# EAGLE design Trivisynth (EAGLE 6.5.0)
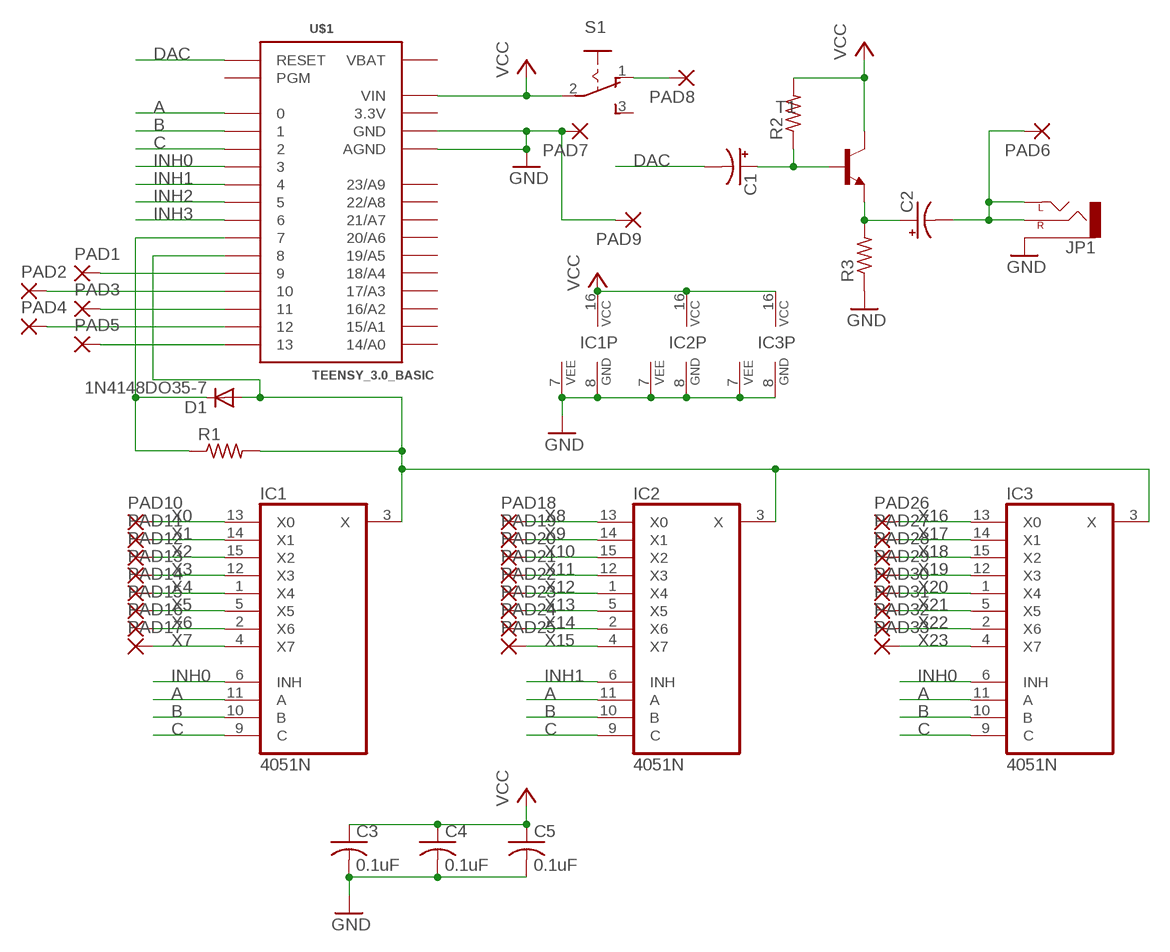
[diagram p0: schematic, sheet 1]

## Parts
C1  CPOL-USE2-5  [E2-5]
C2  CPOL-USE2-5  [E2-5]
C3  0.1uF  C-US025-025X050  [C025-025X050]
C4  0.1uF  C-US025-025X050  [C025-025X050]
C5  0.1uF  C-US025-025X050  [C025-025X050]
D1  1N4148DO35-7  [DO35-7]
IC1  4051N  [DIL16]
IC2  4051N  [DIL16]
IC3  4051N  [DIL16]
JP1  AUDIO-JACKPTH  [AUDIO-JACK]
PAD1  2,15/1,0  [2,15/1,0]
PAD2  2,15/1,0  [2,15/1,0]
PAD3  2,15/1,0  [2,15/1,0]
PAD4  2,15/1,0  [2,15/1,0]
PAD5  2,15/1,0  [2,15/1,0]
PAD6  2,15/1,0  [2,15/1,0]
PAD7  2,15/1,0  [2,15/1,0]
PAD8  2,15/1,0  [2,15/1,0]
PAD9  2,15/1,0  [2,15/1,0]
PAD10  2,15/1,0  [2,15/1,0]
PAD11  2,15/1,0  [2,15/1,0]
PAD12  2,15/1,0  [2,15/1,0]
PAD13  2,15/1,0  [2,15/1,0]
PAD14  2,15/1,0  [2,15/1,0]
PAD15  2,15/1,0  [2,15/1,0]
PAD16  2,15/1,0  [2,15/1,0]
PAD17  2,15/1,0  [2,15/1,0]
PAD18  2,15/1,0  [2,15/1,0]
PAD19  2,15/1,0  [2,15/1,0]
PAD20  2,15/1,0  [2,15/1,0]
PAD21  2,15/1,0  [2,15/1,0]
PAD22  2,15/1,0  [2,15/1,0]
PAD23  2,15/1,0  [2,15/1,0]
PAD24  2,15/1,0  [2,15/1,0]
PAD25  2,15/1,0  [2,15/1,0]
PAD26  2,15/1,0  [2,15/1,0]
PAD27  2,15/1,0  [2,15/1,0]
PAD28  2,15/1,0  [2,15/1,0]
PAD29  2,15/1,0  [2,15/1,0]
PAD30  2,15/1,0  [2,15/1,0]
PAD31  2,15/1,0  [2,15/1,0]
PAD32  2,15/1,0  [2,15/1,0]
PAD33  2,15/1,0  [2,15/1,0]
R1  R-US_0207/10  [0207/10]
R2  R-US_0207/10  [0207/10]
R3  R-US_0207/10  [0207/10]
S1  255SB  [255SB]
T1  -NPN-TO92-EBC  [TO92-EBC]
U$1  TEENSY_3.0_BASIC  [TEENSY_3.0_BASIC]

## Nets
A: IC1.11(A) IC2.11(A) IC3.11(A) U$1.0
B: IC1.10(B) IC2.10(B) IC3.10(B) U$1.1
C: IC1.9(C) IC2.9(C) IC3.9(C) U$1.2
DAC: C1.- U$1.RESET
GND: C3.2 C4.2 C5.2 IC1.7(VEE) IC1.8(GND) IC2.7(VEE) IC2.8(GND) IC3.7(VEE) IC3.8(GND) JP1.SLEEVE PAD7.1(P) PAD9.1(P) R3.1 U$1.AGND U$1.GND U$1.GND1(GND)
INH0: IC1.6(INH) IC3.6(INH) U$1.3
INH1: IC2.6(INH) U$1.4
INH2: U$1.5
INH3: U$1.6
N$1: PAD8.1(P) S1.1(O)
N$2: D1.A IC1.3(X) IC2.3(X) IC3.3(X) R1.2 U$1.8
N$3: C1.+ R2.1 T1.B
N$4: C2.+ R3.2 T1.E
N$5: D1.C R1.1 U$1.7
N$6: C2.- JP1.RING(RIGHT) JP1.TIP(LEFT) PAD6.1(P)
N$7: PAD1.1(P) U$1.9
N$8: PAD2.1(P) U$1.10
N$9: PAD3.1(P) U$1.11
N$10: PAD4.1(P) U$1.12
N$11: PAD5.1(P) U$1.13
VCC: C3.1 C4.1 C5.1 IC1.16(VCC) IC2.16(VCC) IC3.16(VCC) R2.2 S1.2(P) T1.C U$1.VIN
X0: IC1.13(X0) PAD10.1(P)
X1: IC1.14(X1) PAD11.1(P)
X2: IC1.15(X2) PAD12.1(P)
X3: IC1.12(X3) PAD13.1(P)
X4: IC1.1(X4) PAD14.1(P)
X5: IC1.5(X5) PAD15.1(P)
X6: IC1.2(X6) PAD16.1(P)
X7: IC1.4(X7) PAD17.1(P)
X8: IC2.13(X0) PAD18.1(P)
X9: IC2.14(X1) PAD19.1(P)
X10: IC2.15(X2) PAD20.1(P)
X11: IC2.12(X3) PAD21.1(P)
X12: IC2.1(X4) PAD22.1(P)
X13: IC2.5(X5) PAD23.1(P)
X14: IC2.2(X6) PAD24.1(P)
X15: IC2.4(X7) PAD25.1(P)
X16: IC3.13(X0) PAD26.1(P)
X17: IC3.14(X1) PAD27.1(P)
X18: IC3.15(X2) PAD28.1(P)
X19: IC3.12(X3) PAD29.1(P)
X20: IC3.1(X4) PAD30.1(P)
X21: IC3.5(X5) PAD31.1(P)
X22: IC3.2(X6) PAD32.1(P)
X23: IC3.4(X7) PAD33.1(P)
Unconnected: S1.3(S) U$1.14/A0 U$1.15/A1 U$1.16/A2 U$1.17/A3 U$1.18/A4 U$1.19/A5 U$1.20/A6 U$1.21/A7 U$1.22/A8 U$1.23/A9 U$1.PGM

## Power pins joined to a net without a drawn wire
3.3V: U$1.3.3V U$1.3.3V1(3.3V)
VBAT: U$1.VBAT

## Library data of the parts
C1 C2 = rcl:CPOL-US: POLARIZED CAPACITOR, American symbol
C3-C5 = rcl:C-US: CAPACITOR, American symbol
D1 = diode:1N4148: DIODE high speed (Philips)
IC1-IC3 = 40xx:4051: 8-channel ANALOG MULTIPLEXER
JP1 = SparkFun-Connectors:AUDIO-JACK: 3.5mm Audio Jack Simple 3.5mm common PCB mount audio jack. Variant PTH is our storefront SKU PRT-08032
PAD1-PAD33 = wirepad:2,15/1,0: THROUGH-HOLE PAD
R1-R3 = rcl:R-US_: RESISTOR, American symbol
S1 = switch:255SB: SLIDING SWITCH Distributor Buerklin, 11G810
T1 = transistor:*-NPN-: NPN Transistror BF959 corrected 2008.03.06
U$1 = Teensy3.0:TEENSY_3.0_BASIC: Basic Teensy 3.0 with none of the 'inner' pins enabled. See '+4', 'AllAnalogPins", and 'AllPins' packages for additional pin holes, as needed.

## Board
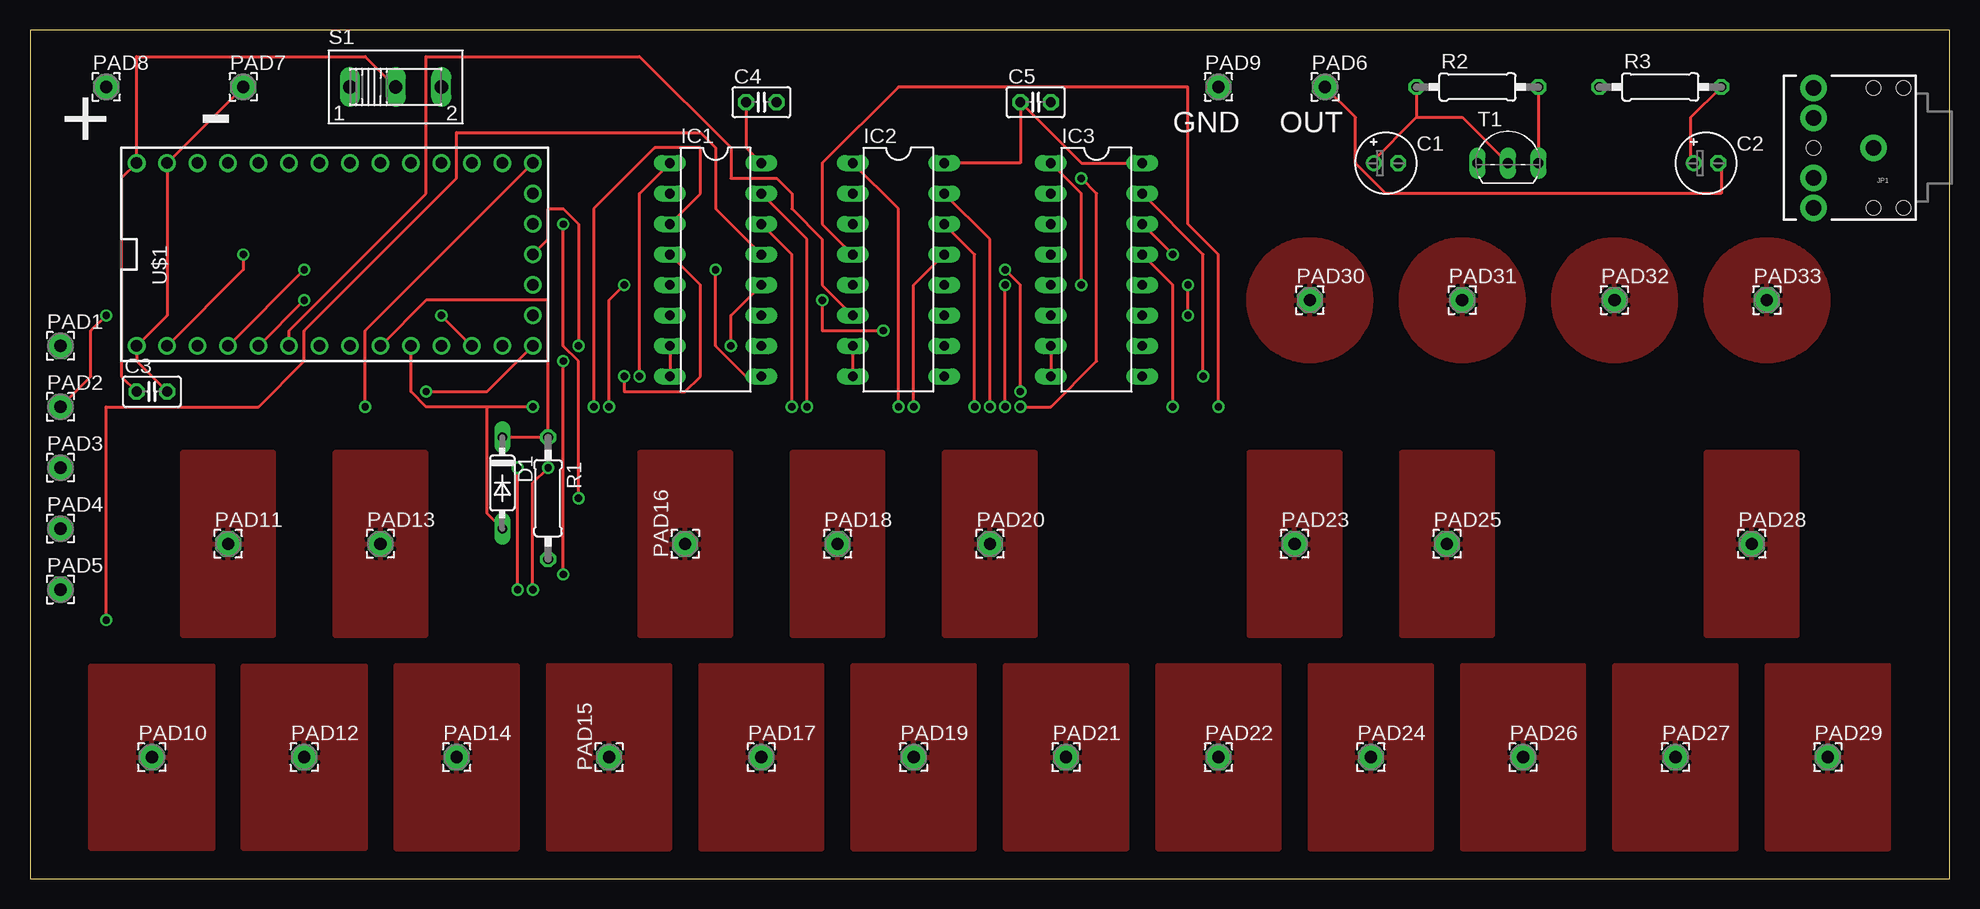
[diagram p1: board, top side]
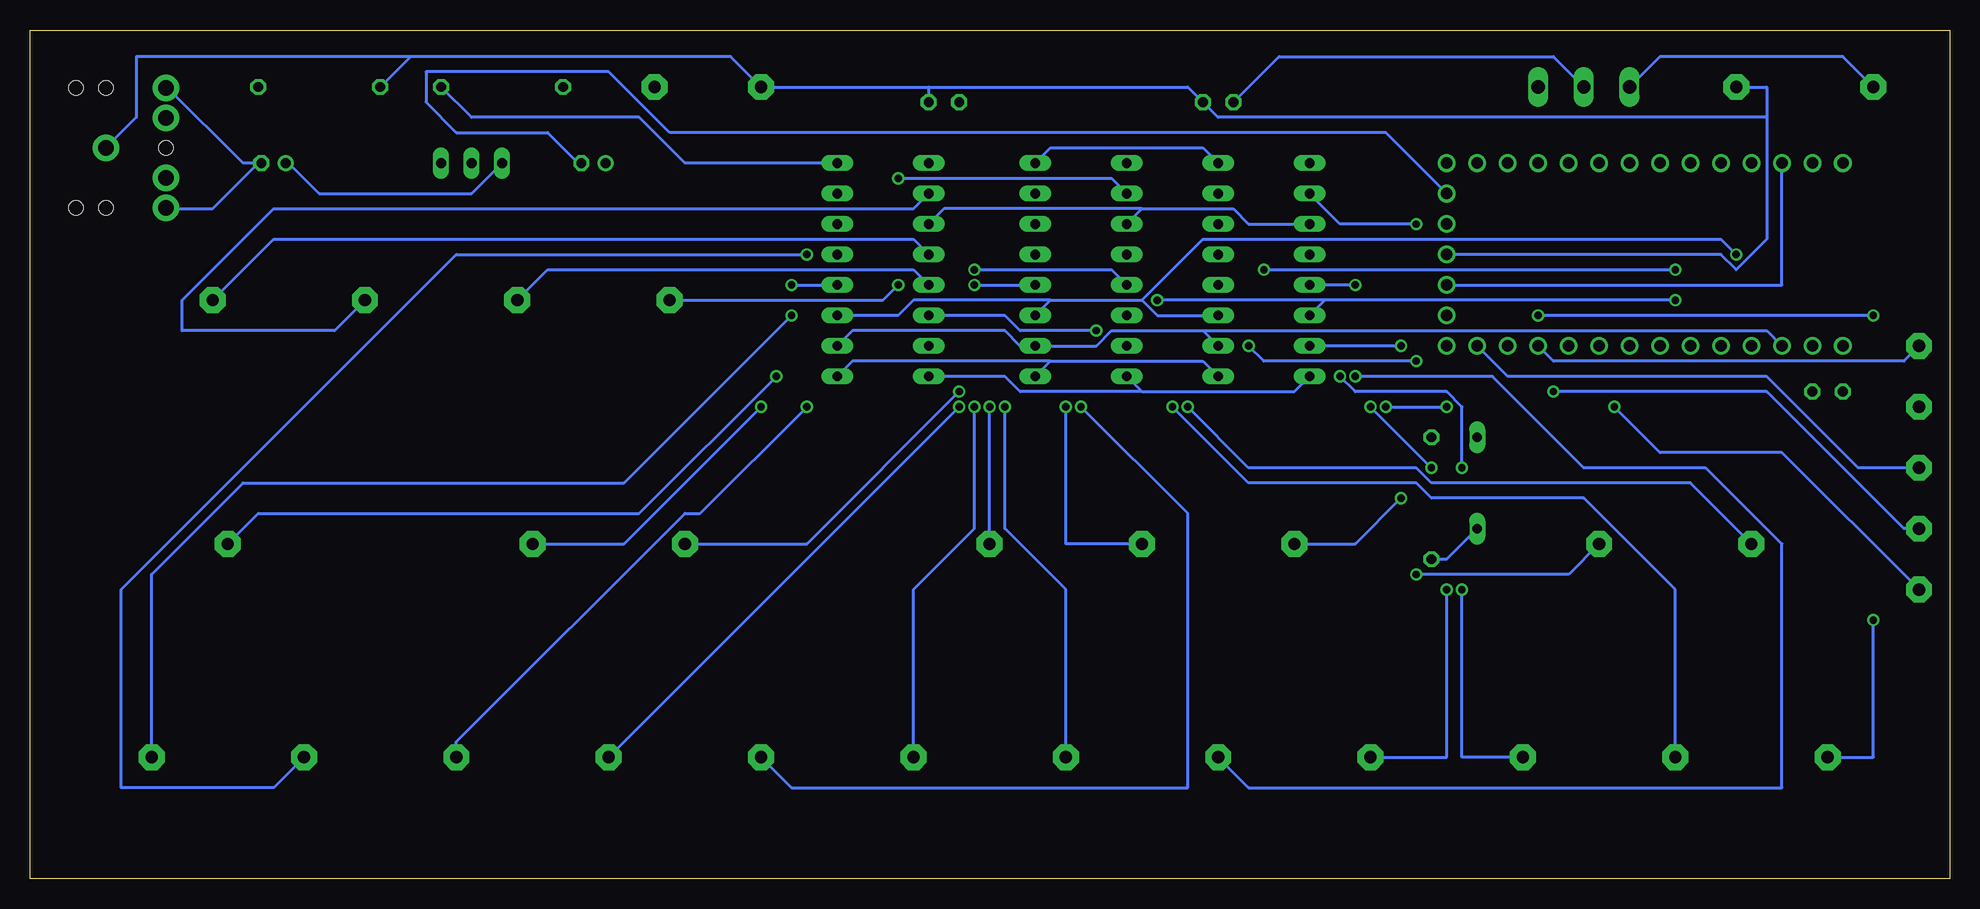
[diagram p2: board, bottom side, seen from below]

Size 160 x 70.79 mm. Coordinates in mm from the lower left corner, seen from the top.
Outline: 0,0 160,0 160,70.79 0,70.79 0,0
Copper layers (1*16): Top 0.035mm / dielectric 1.5mm / Bottom 0.035mm
Design rules "default": minimum track width 10mil, minimum drill 24mil, track to track 8mil, track to pad 8mil, pad to pad 8mil, via to via 8mil, smd to smd 8mil, copper to edge 40mil, drill to drill 8mil, minimum pad ring 10mil, minimum via ring 8mil, stop-mask expansion 4mil, vias tented up to drill 0mil, thermal gap 10mil

### Footprints (pad centres in the part's own frame; a part is rotated, then mirrored left to right if it is on the bottom)
E2-5 = drill 0.813 pad 1.27: + -1.016,0 | drill 0.813 pad 1.27 octagon: - 1.016,0
C025-025X050 = drill 0.813 octagon: 1 -1.27,0; 2 1.27,0
DO35-7 = drill 0.813 long: A 3.81,0; C -3.81,0
DIL16 = drill 0.813 long: 1 -8.89,-3.81; 2 -6.35,-3.81; 3 -3.81,-3.81; 4 -1.27,-3.81; 5 1.27,-3.81; 6 3.81,-3.81; 7 6.35,-3.81; 8 8.89,-3.81; 9 8.89,3.81; 10 6.35,3.81; 11 3.81,3.81; 12 1.27,3.81; 13 -1.27,3.81; 14 -3.81,3.81; 15 -6.35,3.81; 16 -8.89,3.81
AUDIO-JACK = drill 1.3 pad 2.184: RING 5,5; RSH 5,2.5; SLEEVE 0,0; TIP 5,-5; TSH 5,-2.5 | hole 1.2: 0,5; -2.5,5; -2.5,-5; 0,-5; 5,0
2,15/1,0 = drill 1.016 pad 2.159 octagon: 1 0,0
0207/10 = drill 0.813 octagon: 1 -5.08,0; 2 5.08,0
255SB = drill 1.118 long: 1 -3.81,0; 2 0,0; 3 3.81,0
TO92-EBC = drill 0.813 long: B 0,-1.27; C 2.54,-1.27; E -2.54,-1.27
TEENSY_3.0_BASIC = drill 0.965: 0 -7.62,13.97; 1 -7.62,11.43; 2 -7.62,8.89; 3 -7.62,6.35; 3.3V 7.62,11.43; 3.3V1 -2.54,-16.51; 4 -7.62,3.81; 5 -7.62,1.27; 6 -7.62,-1.27; 7 -7.62,-3.81; 8 -7.62,-6.35; 9 -7.62,-8.89; 10 -7.62,-11.43; 11 -7.62,-13.97; 12 -7.62,-16.51; 13 7.62,-16.51; 14/A0 7.62,-13.97; 15/A1 7.62,-11.43; 16/A2 7.62,-8.89; 17/A3 7.62,-6.35; 18/A4 7.62,-3.81; 19/A5 7.62,-1.27; 20/A6 7.62,1.27; 21/A7 7.62,3.81; 22/A8 7.62,6.35; 23/A9 7.62,8.89; AGND 7.62,13.97; GND -7.62,16.51; GND1 0,-16.51; PGM 2.54,-16.51; RESET 5.08,-16.51; VBAT -5.08,-16.51; VIN 7.62,16.51

### Placement (x,y rotation side)
C1  113.03,59.69 0 top
C2  139.7,59.69 0 top
C3  10.16,40.64 0 top
C4  60.96,64.77 0 top
C5  83.82,64.77 0 top
D1  39.37,33.02 270 top
IC1  57.15,50.8 270 top
IC2  72.39,50.8 270 top
IC3  88.9,50.8 270 top
JP1  153.67,60.96 180 top
PAD1  2.54,44.45 0 top
PAD2  2.54,39.37 0 top
PAD3  2.54,34.29 0 top
PAD4  2.54,29.21 0 top
PAD5  2.54,24.13 0 top
PAD6  107.95,66.04 0 top
PAD7  17.78,66.04 0 top
PAD8  6.35,66.04 0 top
PAD9  99.06,66.04 0 top
PAD10  10.16,10.16 0 top
PAD11  16.51,27.94 0 top
PAD12  22.86,10.16 0 top
PAD13  29.21,27.94 0 top
PAD14  35.56,10.16 0 top
PAD15  48.26,10.16 90 top
PAD16  54.61,27.94 90 top
PAD17  60.96,10.16 0 top
PAD18  67.31,27.94 0 top
PAD19  73.66,10.16 0 top
PAD20  80.01,27.94 0 top
PAD21  86.36,10.16 0 top
PAD22  99.06,10.16 0 top
PAD23  105.41,27.94 0 top
PAD24  111.76,10.16 0 top
PAD25  118.11,27.94 0 top
PAD26  124.46,10.16 0 top
PAD27  137.16,10.16 0 top
PAD28  143.51,27.94 0 top
PAD29  149.86,10.16 0 top
PAD30  106.68,48.26 0 top
PAD31  119.38,48.26 0 top
PAD32  132.08,48.26 0 top
PAD33  144.78,48.26 0 top
R1  43.18,31.75 270 top
R2  120.65,66.04 0 top
R3  135.89,66.04 0 top
S1  30.48,66.04 0 top
T1  123.19,60.96 0 top
U$1  25.4,52.07 90 top

### Tracks (layer width: path | path; a pad name or v marks a point on that pad's centre or on a via)
3.3V
  Bottom 0.254: U$1.3.3V 13.97,49.53 U$1.3.3V1
A  (via drill 0.61)
  Top 0.254: U$1.0 17.78,50.8 v17.78,52.07
  Bottom 0.254: IC1.11 66.04,46.99 67.31,48.26 | 74.93,48.26 67.31,48.26 | IC2.11 74.93,48.26 | IC3.11 87.63,46.99 86.36,48.26 74.93,48.26 | v17.78,52.07 19.05,53.34 62.23,53.34 67.31,48.26
B
  Bottom 0.254: 62.23,45.72 IC1.10 | 62.23,45.72 69.85,45.72 71.12,44.45 IC2.10 77.47,44.45 78.74,45.72 91.44,45.72 IC3.10 | U$1.1 15.24,45.72 62.23,45.72
C  (via drill 0.61)
  Top 0.254: v22.86,50.8 U$1.2 | v57.15,50.8 57.15,44.45 59.69,41.91 IC1.9
  Bottom 0.254: IC1.9 62.23,43.18 74.93,43.18 | IC2.9 74.93,43.18 | IC3.9 91.44,43.18 74.93,43.18 | v57.15,50.8 v22.86,50.8
DAC
  Bottom 0.254: U$1.RESET 46.99,62.23 106.68,62.23 111.76,67.31 127,67.31 127,64.77 124.46,62.23 116.84,62.23 114.3,59.69 C1.-
GND  (via drill 0.61)
  Top 0.254: IC3.7 IC3.8 | IC1.7 IC1.8 | IC2.7 IC2.8 | C3.2 8.89,43.18 U$1.GND 11.43,46.99 U$1.AGND PAD7.1 | v45.72,44.45 45.72,54.61 44.45,55.88 43.18,55.88 43.18,53.34 U$1.GND1
  Bottom 0.254: 85.09,66.04 PAD9.1 101.6,68.58 128.27,68.58 | 85.09,66.04 63.5,66.04 C4.2 60.96,63.5 15.24,63.5 | 85.09,66.04 C5.2 | 128.27,68.58 R3.1 | JP1.SLEEVE 151.13,63.5 151.13,68.58 128.27,68.58 | IC1.8 54.61,40.64 67.31,40.64 | IC2.8 67.31,40.64 | IC3.8 78.74,41.91 77.47,40.64 67.31,40.64 | U$1.GND1 19.05,52.07 17.78,50.8 15.24,53.34 15.24,63.5 | 15.24,63.5 15.24,66.04 PAD7.1 | v45.72,44.45 IC1.7
INH0  (via drill 0.61)
  Top 0.254: U$1.3 v22.86,48.26 | v71.12,45.72 66.04,45.72 v66.04,48.26
  Bottom 0.254: 52.07,48.26 IC1.6 | v22.86,48.26 52.07,48.26 | IC3.6 78.74,46.99 77.47,45.72 v71.12,45.72 | 52.07,48.26 v66.04,48.26
INH1
  Top 0.254: IC2.6 66.04,49.53 66.04,53.34 63.5,55.88 63.5,57.15 62.23,58.42 58.42,58.42 58.42,60.96 50.8,68.58 33.02,68.58 33.02,57.15 21.59,45.72 U$1.4
N$1
  Bottom 0.254: S1.1 24.13,68.58 8.89,68.58 PAD8.1
N$2  (via drill 0.61)
  Top 0.254: U$1.8 31.75,40.64 33.02,39.37 38.1,39.37 | 38.1,39.37 38.1,30.48 D1.A | v41.91,39.37 38.1,39.37 | v46.99,39.37 46.99,55.88 52.07,60.96 55.88,60.96 55.88,57.15 IC1.3
  Bottom 0.254: D1.A 41.91,26.67 R1.2 | IC1.3 58.42,54.61 59.69,55.88 67.31,55.88 | IC2.3 67.31,55.88 | IC3.3 83.82,55.88 67.31,55.88 | v46.99,39.37 v41.91,39.37
N$3
  Top 0.254: 115.57,63.5 111.76,59.69 C1.+ | R2.1 115.57,63.5 | T1.B 119.38,63.5 115.57,63.5
N$4
  Top 0.254: R3.2 138.43,63.5 138.43,59.69 C2.+
  Bottom 0.254: T1.E 123.19,57.15 135.89,57.15 138.43,59.69 C2.+
N$5
  Top 0.254: D1.C R1.1 43.18,48.26 33.02,48.26 U$1.7
N$6
  Top 0.254: PAD6.1 110.49,63.5 110.49,59.69 113.03,57.15 140.97,57.15 140.97,59.69 C2.-
  Bottom 0.254: 140.97,59.69 144.78,55.88 148.59,55.88 JP1.RING | 140.97,59.69 142.24,59.69 148.59,66.04 JP1.TIP | 140.97,59.69 C2.-
N$7
  Bottom 0.254: U$1.9 33.02,43.18 3.81,43.18 PAD1.1
N$8  (via drill 0.61)
  Top 0.254: v34.29,46.99 U$1.10 | v6.35,46.99 5.08,45.72 5.08,41.91 PAD2.1
  Bottom 0.254: v6.35,46.99 v34.29,46.99
N$9
  Bottom 0.254: U$1.11 36.83,41.91 15.24,41.91 7.62,34.29 PAD3.1
N$10  (via drill 0.61)
  Top 0.254: U$1.12 38.1,40.64 v33.02,40.64
  Bottom 0.254: v33.02,40.64 15.24,40.64 3.81,29.21 PAD4.1
N$11  (via drill 0.61)
  Top 0.254: U$1.13 27.94,45.72 v27.94,39.37
  Bottom 0.254: v27.94,39.37 24.13,35.56 13.97,35.56 PAD5.1
VCC
  Top 0.254: C3.1 7.62,41.91 7.62,58.42 U$1.VIN 8.89,68.58 27.94,68.58 S1.2 | R2.2 T1.C | IC1.16 59.69,60.96 C4.1 | IC2.16 82.55,59.69 C5.1 87.63,59.69 IC3.16
  Bottom 0.254: IC1.16 62.23,60.96 74.93,60.96 IC2.16 | R2.2 123.19,63.5 109.22,63.5 105.41,59.69 IC3.16 | S1.2 33.02,68.58 55.88,68.58 C4.1
X0  (via drill 0.61)
  Top 0.254: IC1.13 57.15,55.88 57.15,60.96 55.88,62.23 35.56,62.23 35.56,58.42 22.86,45.72 22.86,43.18 19.05,39.37 6.35,39.37 v6.35,21.59
  Bottom 0.254: v6.35,21.59 6.35,10.16 PAD10.1
  pour Top: 5.08,2.54 5.08,17.78 15.24,17.78 15.24,2.54
X1  (via drill 0.61)
  Top 0.254: IC1.14 63.5,52.07 v63.5,39.37
  Bottom 0.254: v63.5,39.37 58.42,34.29 44.45,34.29 43.18,33.02 21.59,33.02 PAD11.1
  pour Top: 12.7,20.32 20.32,20.32 20.32,35.56 12.7,35.56
X2  (via drill 0.61)
  Top 0.254: IC1.15 64.77,53.34 v64.77,39.37
  Bottom 0.254: v64.77,39.37 58.42,33.02 44.45,33.02 43.18,31.75 30.48,31.75 22.86,24.13 PAD12.1
  pour Top: 17.78,2.54 17.78,17.78 27.94,17.78 27.94,2.54
X3  (via drill 0.61)
  Top 0.254: IC1.12 58.42,46.99 v58.42,44.45 | v44.45,25.4 v44.45,43.18
  Bottom 0.254: v58.42,44.45 57.15,43.18 v44.45,43.18 | v44.45,25.4 31.75,25.4 PAD13.1
  pour Top: 25.4,20.32 33.02,20.32 33.02,35.56 25.4,35.56
X4  (via drill 0.61)
  Top 0.254: IC1.1 50.8,57.15 v50.8,41.91 | v40.64,24.13 v40.64,34.29
  Bottom 0.254: v50.8,41.91 49.53,40.64 41.91,40.64 40.64,39.37 v40.64,34.29 | v40.64,24.13 40.64,10.16 PAD14.1
  pour Top: 30.48,2.54 40.64,2.54 40.64,17.78 30.48,17.78
X5  (via drill 0.61)
  Top 0.254: v49.53,49.53 48.26,48.26 v48.26,39.37 | v43.18,34.29 41.91,33.02 v41.91,24.13
  Bottom 0.254: v49.53,49.53 IC1.5 | v43.18,34.29 v48.26,39.37 | v41.91,24.13 41.91,10.16 PAD15.1
  pour Top: 43.18,2.54 53.34,2.54 53.34,17.78 43.18,17.78
X6  (via drill 0.61)
  Top 0.254: v44.45,54.61 44.45,44.45 45.72,43.18 v45.72,31.75
  Bottom 0.254: IC1.2 50.8,54.61 v44.45,54.61 | v45.72,31.75 49.53,27.94 PAD16.1
  pour Top: 50.8,20.32 58.42,20.32 58.42,35.56 50.8,35.56
X7  (via drill 0.61)
  Top 0.254: IC1.4 55.88,49.53 55.88,41.91 54.61,40.64 49.53,40.64 v49.53,41.91
  Bottom 0.254: v49.53,41.91 38.1,41.91 30.48,34.29 20.32,34.29 13.97,27.94 13.97,7.62 58.42,7.62 PAD17.1
  pour Top: 55.88,2.54 66.04,2.54 66.04,17.78 55.88,17.78
X8  (via drill 0.61)
  Top 0.254: IC2.13 73.66,49.53 v73.66,39.37
  Bottom 0.254: v73.66,39.37 73.66,27.94 PAD18.1
  pour Top: 63.5,20.32 71.12,20.32 71.12,35.56 63.5,35.56
X9  (via drill 0.61)
  Top 0.254: IC2.14 78.74,52.07 v78.74,39.37
  Bottom 0.254: v78.74,39.37 78.74,29.21 73.66,24.13 PAD19.1
  pour Top: 68.58,2.54 78.74,2.54 78.74,17.78 68.58,17.78
X10  (via drill 0.61)
  Top 0.254: IC2.15 80.01,53.34 v80.01,39.37
  Bottom 0.254: PAD20.1 v80.01,39.37
  pour Top: 76.2,20.32 83.82,20.32 83.82,35.56 76.2,35.56
X11  (via drill 0.61)
  Top 0.254: v81.28,39.37 v81.28,49.53
  Bottom 0.254: v81.28,49.53 IC2.12 | v81.28,39.37 81.28,29.21 86.36,24.13 PAD21.1
  pour Top: 81.28,2.54 91.44,2.54 91.44,17.78 81.28,17.78
X12  (via drill 0.61)
  Top 0.254: IC2.1 72.39,55.88 v72.39,39.37
  Bottom 0.254: v72.39,39.37 63.5,30.48 63.5,7.62 96.52,7.62 PAD22.1
  pour Top: 93.98,2.54 104.14,2.54 104.14,17.78 93.98,17.78
X13  (via drill 0.61)
  Top 0.254: v81.28,50.8 82.55,49.53 v82.55,40.64
  Bottom 0.254: IC2.5 69.85,50.8 v81.28,50.8 | v82.55,40.64 95.25,27.94 PAD23.1
  pour Top: 101.6,20.32 109.22,20.32 109.22,35.56 101.6,35.56
X14  (via drill 0.61)
  Top 0.254: v87.63,58.42 88.9,57.15 88.9,43.18 85.09,39.37 v82.55,39.37
  Bottom 0.254: IC2.2 69.85,58.42 v87.63,58.42 | PAD24.1 v82.55,39.37
  pour Top: 106.68,2.54 116.84,2.54 116.84,17.78 106.68,17.78
X15  (via drill 0.61)
  Top 0.254: IC2.4 66.04,54.61 66.04,59.69 72.39,66.04 96.52,66.04 96.52,54.61 99.06,52.07 v99.06,39.37
  Bottom 0.254: v99.06,39.37 110.49,27.94 PAD25.1
  pour Top: 114.3,20.32 121.92,20.32 121.92,35.56 114.3,35.56
X16  (via drill 0.61)
  Top 0.254: IC3.13 95.25,49.53 v95.25,39.37
  Bottom 0.254: v95.25,39.37 104.14,30.48 105.41,30.48 124.46,11.43 PAD26.1
  pour Top: 119.38,2.54 129.54,2.54 129.54,17.78 119.38,17.78
X17  (via drill 0.61)
  Top 0.254: v95.25,52.07 IC3.14
  Bottom 0.254: v95.25,52.07 124.46,52.07 152.4,24.13 152.4,7.62 139.7,7.62 PAD27.1
  pour Top: 132.08,2.54 142.24,2.54 142.24,17.78 132.08,17.78
X18  (via drill 0.61)
  Top 0.254: IC3.15 97.79,52.07 v97.79,41.91
  Bottom 0.254: v97.79,41.91 109.22,30.48 140.97,30.48 PAD28.1
  pour Top: 139.7,20.32 147.32,20.32 147.32,35.56 139.7,35.56
X19  (via drill 0.61)
  Top 0.254: v96.52,46.99 v96.52,49.53
  Bottom 0.254: v96.52,49.53 IC3.12 | v96.52,46.99 110.49,33.02 142.24,33.02 149.86,25.4 PAD29.1
  pour Top: 144.78,2.54 154.94,2.54 154.94,17.78 144.78,17.78
X20  (via drill 0.61)
  Top 0.254: IC3.1 87.63,57.15 v87.63,49.53
  Bottom 0.254: v87.63,49.53 88.9,48.26 PAD30.1
  pour Top: 101.6,48.26 arc-90 106.68,53.34 arc-90 111.76,48.26 arc-90 106.68,43.18 arc-90
X21
  Bottom 0.254: IC3.5 86.36,50.8 116.84,50.8 PAD31.1
  pour Top: 114.3,48.26 arc-90 119.38,53.34 arc-90 124.46,48.26 arc-90 119.38,43.18 arc-90
X22
  Bottom 0.254: IC3.2 86.36,55.88 139.7,55.88 147.32,48.26 147.32,45.72 134.62,45.72 PAD32.1
  pour Top: 127,48.26 arc-90 132.08,53.34 arc-90 137.16,48.26 arc-90 132.08,43.18 arc-90
X23
  Bottom 0.254: IC3.4 86.36,53.34 139.7,53.34 PAD33.1
  pour Top: 139.7,48.26 arc-90 144.78,53.34 arc-90 149.86,48.26 arc-90 144.78,43.18 arc-90

### Text on the board
tPlace: GND | OUT | + | -